# Altium project Stabilizer_Pounder.PrjPCB (part 5 of 5)

## Sheet Mixer_coupler.SchDoc: Pounder
size 420 x 297 mm; Author: G.Kasprowicz; CompanyName: WUT ISE; DrawnBy: G.Kasprowicz; Organization: WUT ISE; Address1: PW ISE; Address2: Nowowiejska 15/19 00-665 Warsaw; Address3: gkasprow@gmail.com; DocumentNumber: 2; Revision: 1.2.1; SheetNumber: 2; SheetTotal: 7; ModifiedBy: -; CheckedDate: -; Title2: Demodulation; DivGrp: WUT ISE; Designer: G.Kasprowicz; ModifiedDate: -; ProjectName: Sensor Box
Used 2 times, as channels Mixer_coupler, Mixer_coupler. Parts and nets are listed once, with the designators drawn on the sheet.
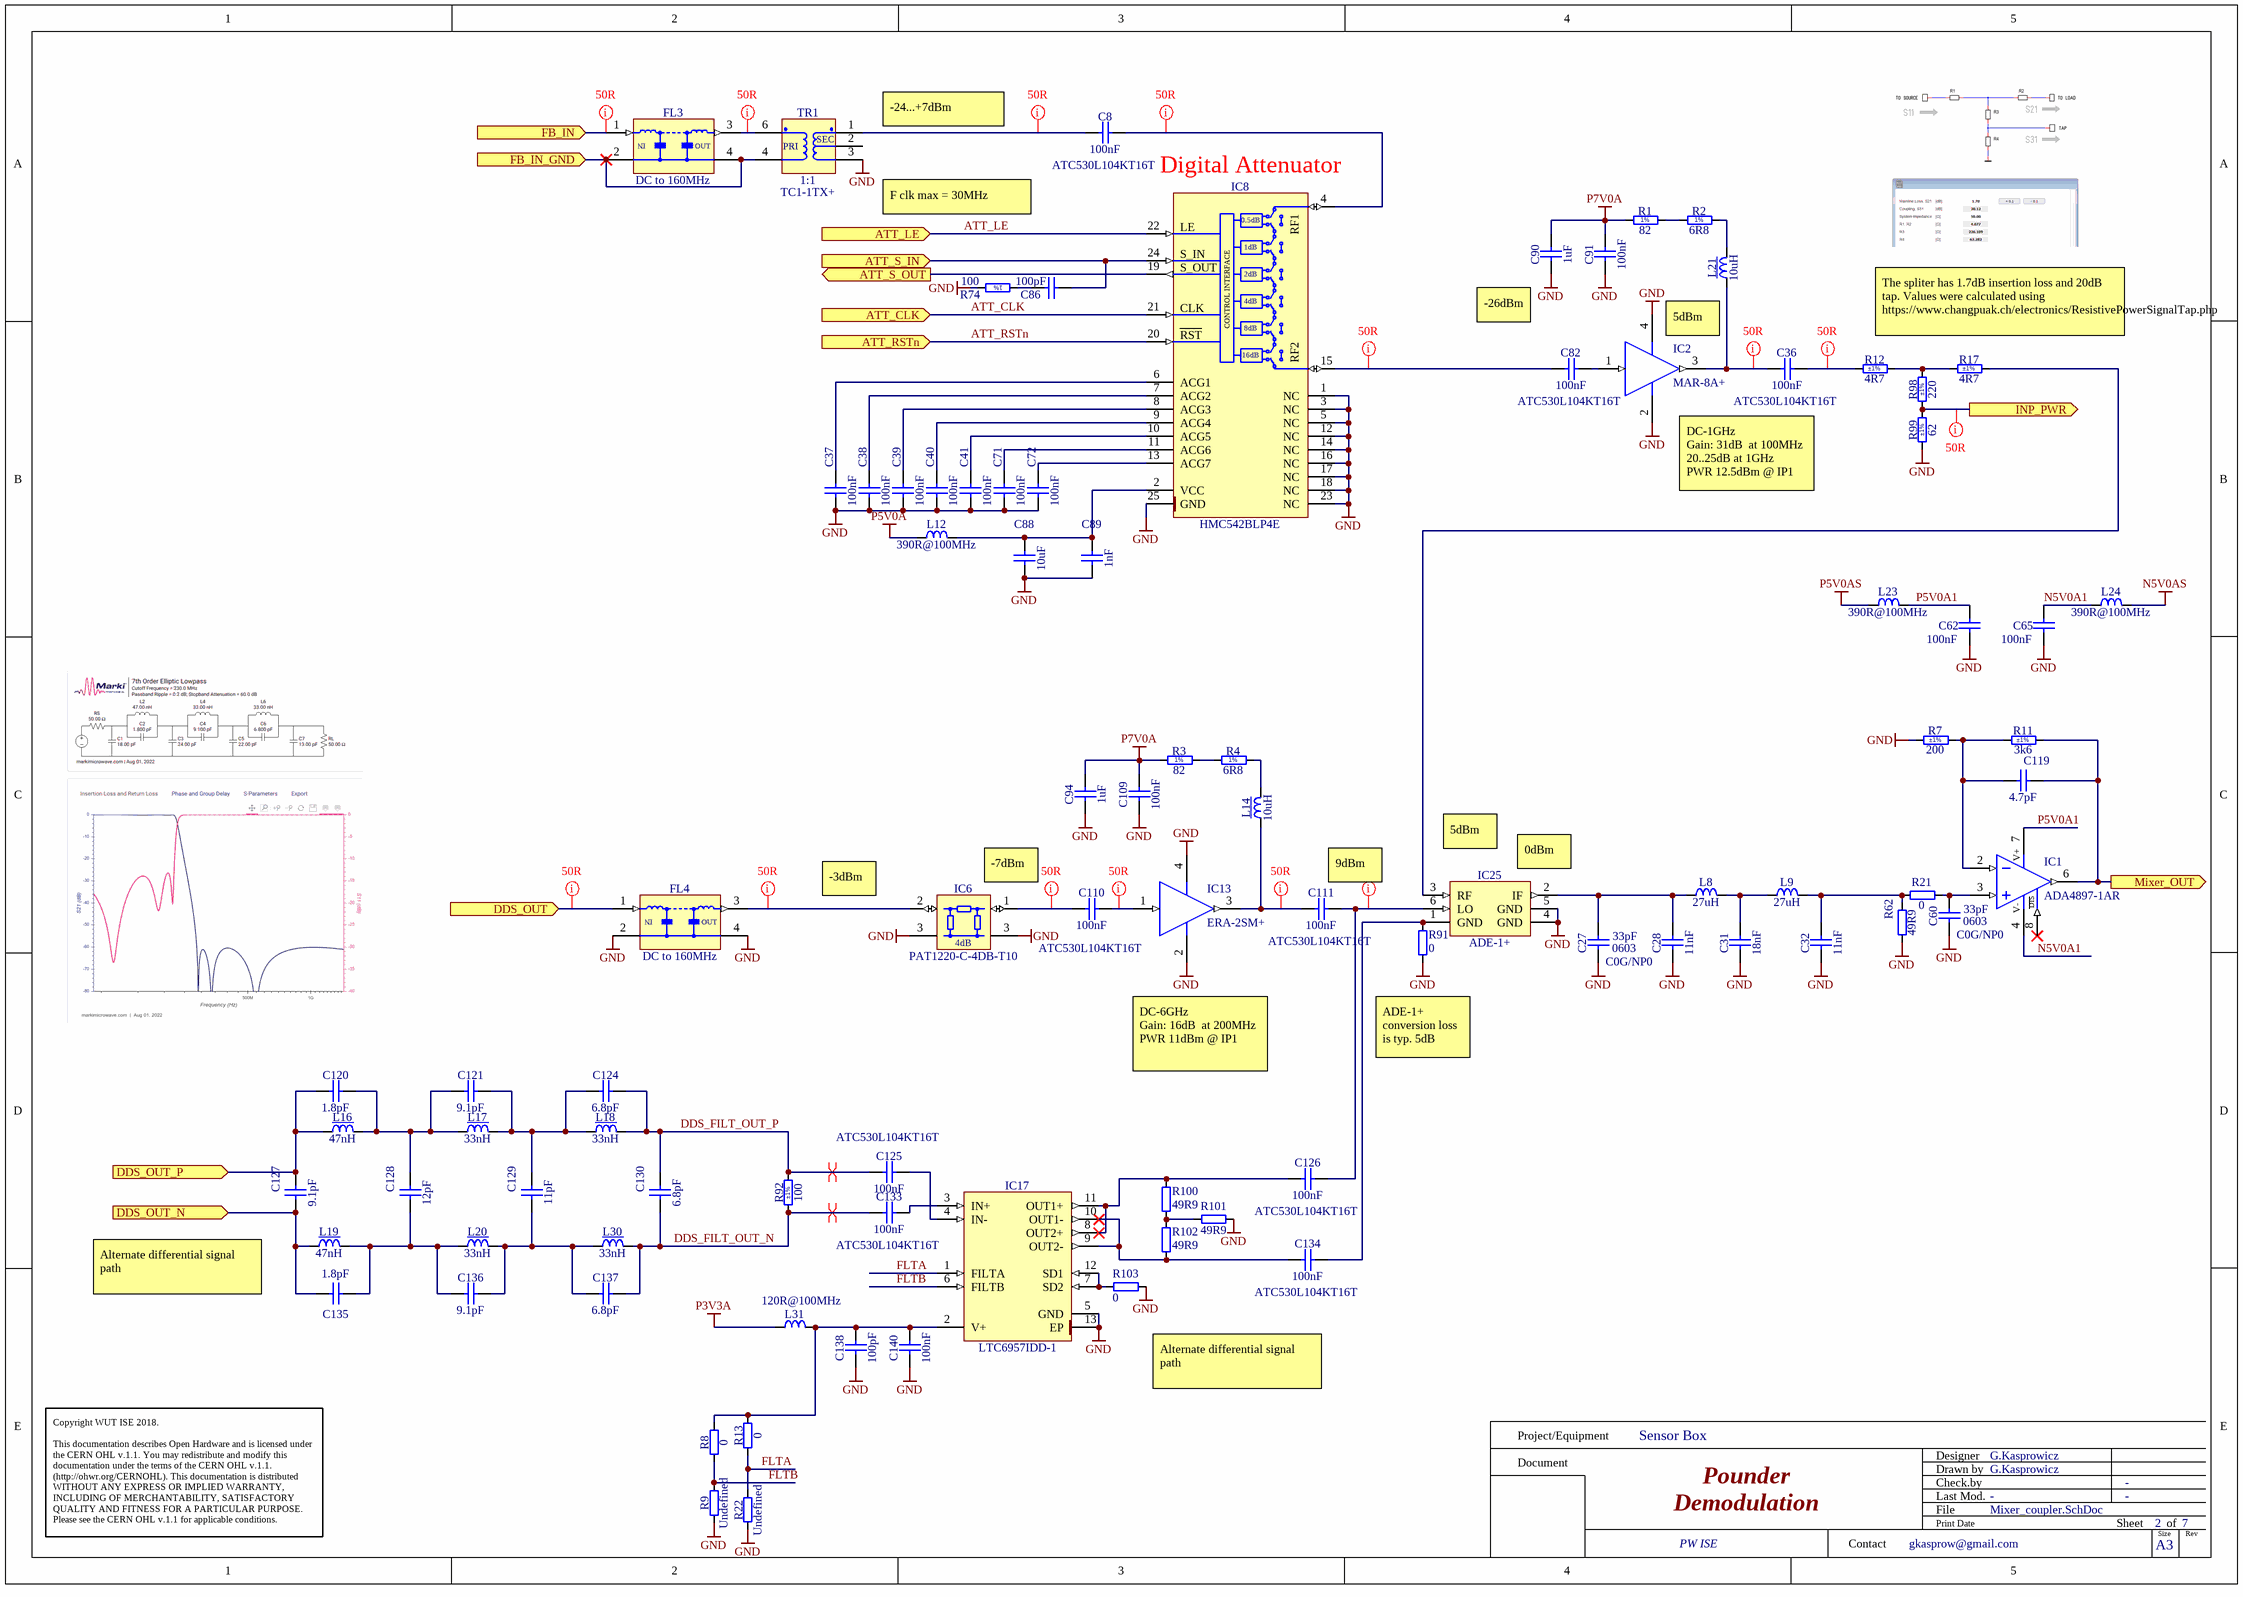
[diagram p6: Mixer_coupler.SchDoc]

### Parts
C8  100nF  Manufacturer Part Number: ATC530L104KT16T  [CAPC1005X70N]
C27  33pF  TC: C0G/NP0  Case: 0603  [CAPC1608X87N]
C28  11nF  [CAPC3216X94N]
C31  18nF  [CAPC3216X94N]
C32  11nF  [CAPC3216X94N]
C36  100nF  Manufacturer Part Number: ATC530L104KT16T  [CAPC1005X70N]
C37  100nF  [CAPC1005X55N]
C38  100nF  [CAPC1005X55N]
C39  100nF  [CAPC1005X55N]
C40  100nF  [CAPC1005X55N]
C41  100nF  [CAPC1005X55N]
C60  33pF  TC: C0G/NP0  Case: 0603  [CAPC1608X87N]
C62  100nF  [CAPC1005X55N]
C65  100nF  [CAPC1005X55N]
C71  100nF  [CAPC1005X55N]
C72  100nF  [CAPC1005X55N]
C82  100nF  Manufacturer Part Number: ATC530L104KT16T  [CAPC1005X70N]
C86  100pF  [CAPC1005X55N]
C88  10uF  [CAPC1608X80N]
C89  1nF  [CAPC1005X55N]
C90  1uF  [CAPC2012X140N]
C91  100nF  [CAPC1005X55N]
C94  1uF  [CAPC2012X140N]
C109  100nF  [CAPC1005X55N]
C110  100nF  Manufacturer Part Number: ATC530L104KT16T  [CAPC1005X70N]
C111  100nF  Manufacturer Part Number: ATC530L104KT16T  [CAPC1005X70N]
C119  4.7pF  [CAPC1005X55N]
C120  1.8pF  [CAPC1005X55N]
C121  9.1pF  [CAPC1005X55N]
C124  6.8pF  [CAPC1005X55N]
C125  100nF  Manufacturer Part Number: ATC530L104KT16T  [CAPC1005X70N]
C126  100nF  Manufacturer Part Number: ATC530L104KT16T  [CAPC1005X70N]
C127  9.1pF  [CAPC1005X55N]
C128  12pF  [CAPC1005X55N]
C129  11pF  [CAPC1005X55N]
C130  6.8pF  [CAPC1005X55N]
C133  100nF  Manufacturer Part Number: ATC530L104KT16T  [CAPC1005X70N]
C134  100nF  Manufacturer Part Number: ATC530L104KT16T  [CAPC1005X70N]
C135  1.8pF  [CAPC1005X55N]
C136  9.1pF  [CAPC1005X55N]
C137  6.8pF  [CAPC1005X55N]
C138  100pF  [CAPC1005X55N]
C140  100nF  [CAPC1005X55N]
FL3  DC to 160MHz  [FIL_MINI-CIRCUITS_FV1206]
FL4  DC to 160MHz  [FIL_MINI-CIRCUITS_FV1206]
IC1  ADA4897-1AR  [SOIC127P600X175-8N]
IC2  MAR-8A+  [MINI-CIRCUITS_VV105]
IC6  PAT1220-C-4DB-T10  [SUSUMU_PAT1220]
IC8  HMC542BLP4E  [QFN50P400X400X100-25N-S295]
IC13  ERA-2SM+  [MINI-CIRCUITS_WW107]
IC17  LTC6957IDD-1  [SON45P300X300X80-13N-R175X248]
IC25  ADE-1+  [MINI-CIRCUITS_CD636]
L8  27uH  [IND_TAIYO-YUDEN_LSQMB201616]
L9  27uH  [IND_TAIYO-YUDEN_LSQMB201616]
L12  390R@100MHz  [INDC1608X95N]
L14  10uH  [IND_MURATA_LQH32C]
L16  47nH  [IND_MURATA_LQW15AN_00]
L17  33nH  [IND_MURATA_LQW15AN_00]
L18  33nH  [IND_MURATA_LQW15AN_00]
L19  47nH  [IND_MURATA_LQW15AN_00]
L20  33nH  [IND_MURATA_LQW15AN_00]
L21  10uH  [IND_MURATA_LQH32C]
L23  390R@100MHz  [INDC1608X95N]
L24  390R@100MHz  [INDC1608X95N]
L30  33nH  [IND_MURATA_LQW15AN_00]
L31  120R@100MHz  [INDC1608X95N]
R1  82  [RESC3216X65N]
R2  6R8  [RESC2012X60N]
R3  82  [RESC3216X65N]
R4  6R8  [RESC2012X60N]
R7  200  Tolerance: ±1%  [RESC1608X55N]
R8  0  [RESC1608X55N]
R9  Undefined  [RESC1608X55N]
R11  3k6  Tolerance: ±1%  [RESC1608X55N]
R12  4R7  Tolerance: ±1%  [RESC1005X40N]
R13  0  [RESC1608X55N]
R17  4R7  Tolerance: ±1%  [RESC1005X40N]
R21  0  [RESC1005X40N]
R22  Undefined  [RESC1608X55N]
R62  49R9  [RESC1608X55N]
R74  100  [RESC1005X40N]
R91  0  [RESC1005X40N]
R92  100  Tolerance: ±1%  [RESC1005X40N]
R98  220  Tolerance: ±1%  [RESC1005X40N]
R99  62  Tolerance: ±1%  [RESC1005X40N]
R100  49R9  [RESC1005X40N]
R101  49R9  [RESC1005X40N]
R102  49R9  [RESC1005X40N]
R103  0  [RESC1005X40N]
TR1  1:1  Manufacturer Part Number: TC1-1TX+  [XFMR_MINI-CIRCUITS_AT1521]

### Ports
ATT_CLK (in), ATT_LE (in), ATT_RSTn (in), ATT_S_IN (in), ATT_S_OUT (out), DDS_OUT (in), DDS_OUT_N (in), DDS_OUT_P (in), FB_IN (in), FB_IN_GND (in), INP_PWR (out), Mixer_OUT (out)

### Nets
GND: C27.1 C28.1 C31.1 C32.1 C37.1 C38.1 C39.1 C40.1 C41.1 C60.1 C62.1 C65.1 C71.1 C72.1 C88.1 C89.1 C90.1 C91.1 C94.1 C109.1 C138.1 C140.1 FL4.2(GND) FL4.4(GND) IC2.2(GND) IC2.4(GND) IC6.3(GND) IC8.1(NC) IC8.3(NC) IC8.5(NC) IC8.12(NC) IC8.14(NC) IC8.16(NC) IC8.17(NC) IC8.18(NC) IC8.23(NC) IC8.25(GND) IC13.2(GND) IC13.4(GND) IC17.5(GND) IC17.13(EP) IC25.4(GND) IC25.5(GND) R7.1 R9.1 R22.1 R62.1 R74.2 R91.2 R99.1 R101.2 R103.1 TR1.3(S)
N5V0AS: L24.2
P3V3A: L31.2
P5V0A: L12.1
P5V0AS: L23.1
P7V0A: C90.2 C91.2 C94.2 C109.2 R1.1 R3.1
ATT_CLK: IC8.21(SHIFT_CLOCK) ; port ATT_CLK
ATT_LE: IC8.22(LATCH_ENABLE) ; port ATT_LE
ATT_RSTn: IC8.20(~{RESET}) ; port ATT_RSTn
ATT_S_IN: C86.2 IC8.24(SERIAL_INPUT) ; port ATT_S_IN
ATT_S_OUT: IC8.19(SERIAL_OUTPUT) ; port ATT_S_OUT
DDS_FILT_OUT_N: C130.1 C133.1 C137.2 L30.2 R92.1
DDS_FILT_OUT_P: C124.2 C125.1 C130.2 L18.2 R92.2
DDS_OUT: FL4.1(RFIN) ; port DDS_OUT
DDS_OUT_N: C127.1 C135.1 L19.1 ; port DDS_OUT_N
DDS_OUT_P: C120.1 C127.2 L16.1 ; port DDS_OUT_P
FB_IN: FL3.1(RFIN) ; port FB_IN
FB_IN_GND: FL3.2(GND) FL3.4(GND) TR1.4(P) ; port FB_IN_GND
FLTA: IC17.1(FILTA) R13.1 R22.2
FLTB: IC17.6(FILTB) R8.1 R9.2
INP_PWR: R98.1 R99.2 ; port INP_PWR
Mixer_OUT: C119.2 IC1.6(OUT) R11.2 ; port Mixer_OUT
N5V0A1: C65.2 IC1.4(V-) L24.1
P5V0A1: C62.2 IC1.7(V+) L23.2
NetC8_1: C8.1 TR1.1(SDOT)
NetC8_2: C8.2 IC8.4(RF1)
NetC27_2: C27.2 C28.2 IC25.2(IF) L8.1
NetC31_2: C31.2 L8.2 L9.1
NetC32_2: C32.2 L9.2 R21.1 R62.2
NetC36_1: C36.1 IC2.3(RF_OUT) L21.1
NetC36_2: C36.2 R12.1
NetC37_2: C37.2 IC8.6(ACG1)
NetC38_2: C38.2 IC8.7(ACG2)
NetC39_2: C39.2 IC8.8(ACG3)
NetC40_2: C40.2 IC8.9(ACG4)
NetC41_2: C41.2 IC8.10(ACG5)
NetC60_2: C60.2 IC1.3(IN+) R21.2
NetC71_2: C71.2 IC8.11(ACG6)
NetC72_2: C72.2 IC8.13(ACG7)
NetC82_1: C82.1 IC8.15(RF2)
NetC82_2: C82.2 IC2.1(RF_IN)
NetC86_1: C86.1 R74.1
NetC88_2: C88.2 C89.2 IC8.2(VCC) L12.2
NetC110_1: C110.1 IC6.1(IN)
NetC110_2: C110.2 IC13.1(RF_IN)
NetC111_1: C111.1 IC13.3(RF_OUT) L14.1
NetC111_2: C111.2 C126.2 IC25.6(LO)
NetC119_1: C119.1 IC1.2(IN-) R7.2 R11.1
NetC120_2: C120.2 C121.1 C128.2 L16.2 L17.1
NetC121_2: C121.2 C124.1 C129.2 L17.2 L18.1
NetC125_2: C125.2 IC17.4(IN-)
NetC126_1: C126.1 IC17.8(OUT2+) IC17.11(OUT1+) R100.1
NetC128_1: C128.1 C135.2 C136.1 L19.2 L20.1
NetC129_1: C129.1 C136.2 C137.1 L20.2 L30.1
NetC133_2: C133.2 IC17.3(IN+)
NetC134_1: C134.1 IC17.9(OUT2-) IC17.10(OUT1-) R102.2
NetC134_2: C134.2 IC25.1(GND) R91.1
NetC138_2: C138.2 C140.2 IC17.2(V+) L31.1 R8.2 R13.2
NetFL3_3: FL3.3(RFOUT) TR1.6(PDOT)
NetFL4_3: FL4.3(RFOUT) IC6.2(OUT)
NetIC17_7: IC17.7(SD2) IC17.12(SD1) R103.2
NetIC25_3: IC25.3(RF) R17.2
NetL14_2: L14.2 R4.2
NetL21_2: L21.2 R2.2
NetR1_2: R1.2 R2.1
NetR3_2: R3.2 R4.1
NetR12_2: R12.2 R17.1 R98.2
NetR100_2: R100.2 R101.1 R102.1

Not connected (* = marked no-connect by the designer): IC1 8(~{DIS})*; TR1 2(NC)

### Channels
Mixer_coupler: designators end in A; ports ATT_CLK=ATT_CLK ATT_LE=ATT_LE ATT_RSTn=ATT_RSTn ATT_S_IN=NetC86A_2 ATT_S_OUT=NetC26B_2 DDS_OUT=NetFL4A_1 DDS_OUT_N=CH3_OUTC_N DDS_OUT_P=CH3_OUTC_P FB_IN=FB1 FB_IN_GND=NetFL3A_2 INP_PWR=NetC114A_1 Mixer_OUT=NetC119A_2
Mixer_coupler: designators end in B; ports ATT_CLK=ATT_CLK ATT_LE=ATT_LE ATT_RSTn=ATT_RSTn ATT_S_IN=NetC86B_2 ATT_S_OUT=NetIC8B_19 DDS_OUT=DDS_OUT1 DDS_OUT_N=CH1_OUTC_N DDS_OUT_P=CH1_OUTC_P FB_IN=FB0 FB_IN_GND=NetFL3B_2 INP_PWR=NetC114B_1 Mixer_OUT=NetC119B_2

### Layout directives
net class Z50R: FB1, NetC8A_1, NetC8A_2, NetC36A_1, NetC36A_2, NetC82A_1, NetC110A_1, NetC110A_2, NetC111A_1, NetC111A_2, NetC114A_1, NetFL3A_3, NetFL4A_1, NetFL4A_3
differential pair: DDS_FILT_OUT_N_Mixer_coupler, DDS_FILT_OUT_P_Mixer_coupler

### Notes on the sheet
- (near TR1) -24...+7dBm
- (near IC8) Digital Attenuator
- F clk max = 30MHz
- (near C90) -26dBm
- (near IC2) 5dBm
- The spliter has 1.7dB insertion loss and 20dB tap. Values were calculated using https://www.changpuak.ch/electronics/ResistivePowerSignalTap.php
- (near IC2) DC-1GHz
  Gain: 31dB  at 100MHz
  20..25dB at 1GHz
  PWR 12.5dBm @ IP1
- (near IC25) 5dBm
- (near IC25) 0dBm
- -3dBm
- (near IC6) -7dBm
- (near C111) 9dBm
- DC-6GHz
  Gain: 16dB  at 200MHz
  PWR 11dBm @ IP1
- (near R91) ADE-1+ conversion loss is typ. 5dB
- Alternate differential signal path
- Project/Equipment
- Document
- Designer
- Drawn by
- Check.by
- Copyright WUT ISE 2018.
  This documentation describes Open Hardware and is licensed under the CERN OHL v.1.1. You may redistribute and modify this documentation under the terms of the CERN OHL v.1.1. (http://ohwr.org/CERNOHL). This documentation is distributed WITHOUT ANY EXPRESS OR IMPLIED WARRANTY, INCLUDING OF MERCHANTABILITY, SATISFACTORY QUALITY AND FITNESS FOR A PARTICULAR PURPOSE. Please see the CERN OHL v.1.1 for applicable conditions.
- Contact
- File
- Last Mod.
- Print Date
- Sheet
- Size
- A3
- of
- Rev
- (in symbol ADA4897-1AR) DIS
- (in symbol FIL_MINI-CIRCUITS_LFCN-160+) IN; OUT
- (in symbol HMC542BLP4E) 0.5dB; LE; 1dB; S_IN; S_OUT; 2dB; CONTROL INTERFACE; 4dB; CLK; 8dB; RST; 16dB
- (in symbol PAT1220-C-4DB-T10) 4dB
- (in symbol R0402_100R_1%_0.0625W_100PPM) 1%
- (in symbol R0805_6R8_1%_0.125W_200PPM) 1%
- (in symbol R1206_82R_1%_0.25W_100PPM) 1%
- (in symbol XFMR_MINI-CIRCUITS_TC1-1TX+) SEC; PRI

### Library data of the parts
C8 C36 C82 C110 C111 C125 C126 C133 C134 = CC0402_100NF_16V_10%_X7R_ATC_ATC530L: Non-polarised capacitor; Part Description: Broadband SMD Multilayer Chip Ceramic Capacitor; Manufacturer: ATC; Voltage: 16V; TC: X7R; Tolerance: ±10%; Part Number: CC0402_100NF_16V_10%_X7R_ATC_ATC530L; Component Kind: Standard; Component Type: Standard; Pin Count: 2; Value: 100nF; Status: Not Recommended; Case: 0402; Mounted: Yes; Socket: No; SMD: Yes; Sense: No; ComponentHeight: 0.61mm; HelpURL: \\cern.ch\dfs\Applications\Altium\Datasheets\CC0402_X7R_ATC_ATC530L104KT16.pdf; Author: CERN DEM BC; CreateDate: 17.11.2017; LatestRevisionDate: 21.11.2017
C27 C60 = CC0603_33PF_50V_5%_NP0: Non-polarised capacitor; Part Description: SMD Multilayer Chip Ceramic Capacitor; Manufacturer: GENERIC; Manufacturer1 Part Number: 223886715339; Voltage: 50V; Tolerance: ±5%; Part Number: CC0603_33PF_50V_5%_NP0; Component Kind: Standard; Component Type: Standard; Pin Count: 2; Value: 33pF; Status: Preferred; Manufacturer Part Number: CC0603_33PF_50V_5%_NP0; Mounted: Yes; Socket: No; SMD: Yes; Sense: No; Manufacturer1 Example: PHYCOMP; Manufacturer1 ComponentHeight: 0.87mm; HelpURL: \\cern.ch\dfs\Applications\Altium\Datasheets\CC0603_NP0_PHYCOMP.pdf; Author: CERN DEM JLC; CreateDate: 03.12.2007; LatestRevisionDate: 03.12.2007
C28 C32 = CC1206_11NF_50V_5%_NP0: Non-polarised capacitor; Part Description: SMD Multilayer Chip Ceramic Capacitor; Manufacturer: GENERIC; Manufacturer1 Part Number: GRM3195C1H113JA01; Voltage: 50V; TC: NP0; Tolerance: ±5%; Part Number: CC1206_11NF_50V_5%_NP0; Component Kind: Standard; Component Type: Standard; Pin Count: 2; Value: 11nF; Status: None; Manufacturer Part Number: CC1206_11NF_50V_5%_NP0; Case: 1206; Mounted: Yes; Socket: No; SMD: Yes; Sense: No; Manufacturer1 Example: MURATA; Manufacturer1 ComponentHeight: 0.95mm; HelpURL: \\cern.ch\dfs\Applications\Altium\Datasheets\CC1206_NP0_MURATA_GRM3195C1H113JA01.pdf; Author: CERN DEM HF; CreateDate: 05.08.2022; LatestRevisionDate: 05.08.2022
C31 = CC1206_18NF_50V_5%_NP0: Non-polarised capacitor; Part Description: SMD Multilayer Chip Ceramic Capacitor; Manufacturer: GENERIC; Manufacturer1 Part Number: GRM3195C1H113JA01; Voltage: 50V; TC: NP0; Tolerance: ±5%; Part Number: CC1206_18NF_50V_5%_NP0; Component Kind: Standard; Component Type: Standard; Pin Count: 2; Value: 18nF; Status: None; Manufacturer Part Number: CC1206_18NF_50V_5%_NP0; Case: 1206; Mounted: Yes; Socket: No; SMD: Yes; Sense: No; Manufacturer1 Example: MURATA; Manufacturer1 ComponentHeight: 0.95mm; HelpURL: \\cern.ch\dfs\Applications\Altium\Datasheets\CC1206_NP0_MURATA_GRM3195C1H183JA01.pdf; Author: CERN DEM HF; CreateDate: 05.08.2022; LatestRevisionDate: 05.08.2022
C37-C41 C71 C72 C91 C109 C140 = CC0402_100NF_16V_10%_X5R: as C14-C20 on sheet Digital_Attenuator; Part Number: CC0402_100NF_16V_10%_X5R; Component Kind: Standard; Component Type: Standard; Pin Count: 2; Value: 100nF; Status: None; Manufacturer Part Number: CC0402_100NF_16V_10%_X5R; Case: 0402; Mounted: Yes; Socket: No; SMD: Yes; Sense: No; Manufacturer1 Example: MURATA; Manufacturer1 ComponentHeight: 0.55mm; HelpURL: \\cern.ch\dfs\Applications\Altium\Datasheets\CC0402_X5R_MURATA_GRM.pdf; Author: CERN DEM JLC; CreateDate: 10.12.2013; LatestRevisionDate: 10.12.2013
C62 C65 = CC0402_100NF_16V_10%_X7R: Non-polarised capacitor; Part Description: SMD Multilayer Chip Ceramic Capacitor; Manufacturer: GENERIC; Manufacturer1 Part Number: GRM155R71C104KA88D; Voltage: 16V; TC: X7R; Tolerance: ±10%; Part Number: CC0402_100NF_16V_10%_X7R; Component Kind: Standard; Component Type: Standard; Pin Count: 2; Value: 100nF; Status: Not Recommended; Manufacturer Part Number: CC0402_100NF_16V_10%_X7R; Case: 0402; Mounted: Yes; Socket: No; SMD: Yes; Sense: No; Manufacturer1 Example: MURATA; Manufacturer1 ComponentHeight: 0.55mm; HelpURL: \\cern.ch\dfs\Applications\Altium\Datasheets\CC0402_X7R_MURATA_GRM.pdf; Author: CERN DEM JLC; CreateDate: 2013-12-05; LatestRevisionDate: 2007-12-03
C86 C138 = CC0402_100PF_50V_5%_C0G: Non-polarised capacitor; Part Description: SMD Multilayer Chip Ceramic Capacitor; Manufacturer: GENERIC; Manufacturer1 Part Number: C0402C101J5GACTU; Voltage: 50V; TC: C0G/NP0; Tolerance: ±5%; Part Number: CC0402_100PF_50V_5%_C0G; Component Kind: Standard; Component Type: Standard; Pin Count: 2; Value: 100pF; Status: Preferred; Manufacturer Part Number: CC0402_100PF_50V_5%_C0G; Case: 0402; Mounted: Yes; Socket: No; SMD: Yes; Sense: No; Manufacturer1 Example: KEMET; Manufacturer1 ComponentHeight: 0.55mm; Author: CERN DEM JLC; CreateDate: 03.12.2007; LatestRevisionDate: 22.04.2015
  C86: HelpURL: \\cern.ch\dfs\Applications\Altium\Datasheets\CC0805_C0G_KEMET_(Commercial Grade).pdf
  C138: HelpURL: \\cern.ch\dfs\Applications\Altium\Datasheets\CC0402_C0G_KEMET_(Commercial Grade).pdf
C88 = CC0603_10UF_16V_20%_X5R: Non-polarised capacitor; Part Description: SMD Multilayer Chip Ceramic Capacitor; Manufacturer: GENERIC; Manufacturer1 Part Number: GRM188R61C106MA73D; Voltage: 16V; TC: X5R; Tolerance: ±20%; Part Number: CC0603_10UF_16V_20%_X5R; Component Kind: Standard; Component Type: Standard; Pin Count: 2; Value: 10uF; Status: None; Manufacturer Part Number: CC0603_10UF_16V_20%_X5R; Case: 0603; Mounted: Yes; Socket: No; SMD: Yes; Sense: No; Manufacturer1 Example: MURATA; Manufacturer1 ComponentHeight: 0.8mm; HelpURL: \\cern.ch\dfs\Applications\Altium\Datasheets\CC0603_X5R_MURATA_GRM.pdf; Author: CERN DEM MR; CreateDate: 2016-03-02; LatestRevisionDate: 2016-03-02
C89 = CC0402_1NF_50V_10%_X7R: Non-polarised capacitor; Part Description: SMD Multilayer Chip Ceramic Capacitor; Manufacturer: GENERIC; Manufacturer1 Part Number: 223858715623; Voltage: 50V; TC: X7R; Tolerance: ±10%; Part Number: CC0402_1NF_50V_10%_X7R; Component Kind: Standard; Component Type: Standard; Pin Count: 2; Value: 1nF; Status: Not Recommended; Manufacturer Part Number: CC0402_1NF_50V_10%_X7R; Case: 0402; Mounted: Yes; Socket: No; SMD: Yes; Sense: No; Manufacturer1 Example: PHYCOMP; Manufacturer1 ComponentHeight: 0.55mm; HelpURL: \\cern.ch\dfs\Applications\Altium\Datasheets\CC0402_X7R_PHYCOMP.pdf; Author: CERN DEM JLC; CreateDate: 2007-12-03; LatestRevisionDate: 2007-12-03
C90 C94 = CC0805_1UF_35V_20%_X7R: Non-polarised capacitor; Part Description: SMD Multilayer Chip Ceramic Capacitor; Manufacturer: GENERIC; Manufacturer1 Part Number: GMK212B7105MG-T; Voltage: 35V; TC: X7R; Tolerance: ±20%; Part Number: CC0805_1UF_35V_20%_X7R; Component Kind: Standard; Component Type: Standard; Pin Count: 2; Value: 1uF; Status: Not Recommended; Manufacturer Part Number: CC0805_1UF_35V_20%_X7R; Case: 0805; Mounted: Yes; Socket: No; SMD: Yes; Sense: No; Manufacturer1 Example: TAIYO YUDEN; Manufacturer1 ComponentHeight: 1.35mm; HelpURL: \\cern.ch\dfs\Applications\Altium\Datasheets\CC0805_X7R_TAIYO-YUDEN_HIGH-VALUE.pdf; Author: CERN DEM JLC; CreateDate: 2011-06-22; LatestRevisionDate: 2011-06-22
C119 = CC0402_4.7PF_50V_0.25PF_C0G: Non-polarised capacitor; Part Description: SMD Multilayer Chip Ceramic Capacitor; Manufacturer: GENERIC; Manufacturer1 Part Number: C0402C479C5GACTU; Voltage: 50V; TC: C0G/NP0; Tolerance: ±0.25pF; Part Number: CC0402_4.7PF_50V_0.25PF_C0G; Component Kind: Standard; Component Type: Standard; Pin Count: 2; Value: 4.7pF; Status: Preferred; Manufacturer Part Number: CC0402_4.7PF_50V_0.25PF_C0G; Case: 0402; Mounted: Yes; Socket: No; SMD: Yes; Sense: No; Manufacturer1 Example: KEMET; Manufacturer1 ComponentHeight: 0.55mm; HelpURL: \\cern.ch\dfs\Applications\Altium\Datasheets\CC0402_C0G_KEMET_(Commercial Grade).pdf; Author: CERN DEM JLC; CreateDate: 03.12.2007; LatestRevisionDate: 22.04.2015
C120 C135 = CC0402_1.8PF_50V_0.25PF_C0G: Non-polarised capacitor; Part Description: SMD Multilayer Chip Ceramic Capacitor; Manufacturer: GENERIC; Manufacturer1 Part Number: C0402C189C5GACTU; Voltage: 50V; TC: C0G/NP0; Tolerance: ±0.25pF; Part Number: CC0402_1.8PF_50V_0.25PF_C0G; Component Kind: Standard; Component Type: Standard; Pin Count: 2; Value: 1.8pF; Status: Preferred; Manufacturer Part Number: CC0402_1.8PF_50V_0.25PF_C0G; Case: 0402; Mounted: Yes; Socket: No; SMD: Yes; Sense: No; Manufacturer1 Example: KEMET; Manufacturer1 ComponentHeight: 0.55mm; HelpURL: \\cern.ch\dfs\Applications\Altium\Datasheets\CC0402_C0G_KEMET_(Commercial Grade).pdf; Author: CERN DEM JLC; CreateDate: 04.10.2016; LatestRevisionDate: 04.10.2016
C121 C127 C136 = CC0402_9.1PF_50V_0.1pF_C0G: Non-polarised capacitor; Part Description: SMD Multilayer Chip Ceramic Capacitor; Manufacturer: GENERIC; Manufacturer1 Part Number: GJM1555C1H9R1BB01D; Voltage: 50V; TC: C0G/NP0; Tolerance: ±0.1pF; Part Number: CC0402_9.1PF_50V_0.1pF_C0G; Component Kind: Standard; Component Type: Standard; Pin Count: 2; Value: 9.1pF; Status: Preferred; Manufacturer Part Number: CC0402_9.1PF_50V_0.1pF_C0G; Case: 0402; Mounted: Yes; Socket: No; SMD: Yes; Sense: No; Manufacturer1 Example: Murata; Manufacturer1 ComponentHeight: 0.55mm; HelpURL: \\cern.ch\dfs\Applications\Altium\Datasheets\CC0402_C0G_KEMET_(Commercial Grade).pdf; Author: GK; CreateDate: 04.10.2016; LatestRevisionDate: 04.10.2016
C124 C130 C137 = CC0402_6.8PF_50V_0.1pF_C0G: Non-polarised capacitor; Part Description: SMD Multilayer Chip Ceramic Capacitor; Manufacturer: GENERIC; Manufacturer1 Part Number: GJM1555C1H6R8BB01D; Voltage: 50V; TC: C0G/NP0; Tolerance: ±0.1pF; Part Number: CC0402_6.8PF_50V_0.1pF_C0G; Component Kind: Standard; Component Type: Standard; Pin Count: 2; Value: 6.8pF; Status: Preferred; Manufacturer Part Number: CC0402_6.8PF_50V_0.1pF_C0G; Case: 0402; Mounted: Yes; Socket: No; SMD: Yes; Sense: No; Manufacturer1 Example: Murata; Manufacturer1 ComponentHeight: 0.55mm; HelpURL: \\cern.ch\dfs\Applications\Altium\Datasheets\CC0402_C0G_KEMET_(Commercial Grade).pdf; Author: GK; CreateDate: 04.10.2016; LatestRevisionDate: 04.10.2016
C128 = CC0402_12PF_50V_5%_C0G: Non-polarised capacitor; Part Description: SMD Multilayer Chip Ceramic Capacitor; Manufacturer: GENERIC; Manufacturer1 Part Number: C0402C120J5GACTU; Voltage: 50V; TC: C0G/NP0; Tolerance: ±5%; Part Number: CC0402_12PF_50V_5%_C0G; Component Kind: Standard; Component Type: Standard; Pin Count: 2; Value: 12pF; Status: Preferred; Manufacturer Part Number: CC0402_12PF_50V_5%_C0G; Case: 0402; Mounted: Yes; Socket: No; SMD: Yes; Sense: No; Manufacturer1 Example: KEMET; Manufacturer1 ComponentHeight: 0.55mm; HelpURL: \\cern.ch\dfs\Applications\Altium\Datasheets\CC0402_C0G_KEMET_(Commercial Grade).pdf; Author: CERN DEM JLC; CreateDate: 04.10.2016; LatestRevisionDate: 04.10.2016
C129 = CC0402_11PF_25V_1%_C0G: Non-polarised capacitor; Part Description: SMD Multilayer Chip Ceramic Capacitor; Manufacturer: GENERIC; Manufacturer1 Part Number: 04023J110FBSTR; Voltage: 25V; TC: C0G/NP0; Tolerance: ±1%; Part Number: CC0402_11PF_25V_1%_C0G; Component Kind: Standard; Component Type: Standard; Pin Count: 2; Value: 11pF; Status: Preferred; Manufacturer Part Number: CC0402_11PF_25V_1%_C0G; Case: 0402; Mounted: Yes; Socket: No; SMD: Yes; Sense: No; Manufacturer1 Example: Kyocera; Manufacturer1 ComponentHeight: 0.55mm; HelpURL: \\cern.ch\dfs\Applications\Altium\Datasheets\CC0402_C0G_KEMET_(Commercial Grade).pdf; Author: GK; CreateDate: 04.10.2016; LatestRevisionDate: 04.10.2016
FL3 FL4 = FIL_MINI-CIRCUITS_LFCN-160+: 50 Ohms DC to 160MHz Low Pass Filter; Part Description: 50 Ohm Low Pass Filter; Part Number: FIL_MINI-CIRCUITS_LFCN-160+; Component Kind: Standard; Component Type: Standard; Pin Count: 2; Value: DC to 160MHz; Status: None; Manufacturer: MINI-CIRCUITS; Manufacturer Part Number: LFCN-160+; Mounted: Yes; Socket: No; SMD: Yes; Sense: No; ComponentHeight: 0.94mm; HelpURL: \\cern.ch\dfs\Applications\Altium\Datasheets\FIL_MINI-CIRCUITS_LFCN-160+.pdf; Author: CERN DEM MR; CreateDate: 18.10.2019; LatestRevisionDate: 18.10.2019
IC1 = ADA4897-1AR: Operational Amplifier with Disable; Part Description: 1nV/sqrt Hz, Low Power, Rail-to-Rail Output Amplifier; Manufacturer: ANALOG DEVICES; PressFit: No; Bonding: No; Part Number: ADA4897-1AR; Component Kind: Standard; Component Type: Standard; Device: ADA4897-1AR; PackageDescription: SOIC 8, Pitch 1.27mm - Body 4x5mm, IPC Medium Density; Manufacturer Part Number: ADA4897-1AR; Pin Count: 8; Case: SOIC8; Mounted: Yes; Socket: No; SMD: Yes; Sense: No; ComponentHeight: 1.75mm; Author: CERN DEM HF; HelpURL: \\cern.ch\dfs\Applications\Altium\Datasheets\ADA4897.pdf; CreateDate: 04.08.2022; LatestRevisionDate: 04.08.2022
IC2 = RF_MAR-8A+: SMT Gain Block, DC - 1000 MHz, 50Ω; Manufacturer: MINI-CIRCUITS; PressFit: No; Bonding: No; Part Number: MAR-8A+; Component Kind: Standard; Component Type: Standard; Device: MAR-8A+; PackageDescription: MINI-CIRCUITS VV105 Case, Body 2.16mm Diameter X 1.22mm H; Part Description: SMT Gain Block, DC - 1000 MHz, 50Ω; Manufacturer Part Number: MAR-8A+; Pin Count: 4; Mounted: Yes; Socket: No; SMD: Yes; Sense: No; ComponentHeight: 1.22mm; Author: GK; HelpURL: \\cern.ch\dfs\Applications\Altium\Datasheets\ERA-3+.pdf; CreateDate: 02.10.2017; LatestRevisionDate: 02.10.2017
IC6 = PAT1220-C-4DB-T10: DC to 10GHz, 100mW, 50 Ohm, 4dB, Precision Chip Attenuator; Manufacturer: SUSUMU; PressFit: No; Bonding: No; Part Number: PAT1220-C-4DB-T10; Component Kind: Standard; Component Type: Standard; Device: PAT1220-C-4DB-T10; PackageDescription: SUSUMU PAT1220, 4 Pin Attenuator, Size 0805, L 2.00 x W 1.25 H 0.5mm; Part Description: DC to 10GHz, 100mW, 50 Ohm, 4dB, Precision Chip Attenuator; Manufacturer Part Number: PAT1220-C-4DB-T10; Pin Count: 4; Mounted: Yes; Socket: No; SMD: Yes; Sense: No; ComponentHeight: 0.5mm; Author: CERN DEM MR; HelpURL: \\cern.ch\dfs\Applications\Altium\Datasheets\PAT1220-C-4DB-T10.pdf; CreateDate: 04.10.2017; LatestRevisionDate: 04.10.2017
IC8 = HMC542BLP4E: 0.5dB LSB GaAs MMIC 6-bit Digital Serial Control Attenuator, DC - 4GHz; Part Description: 0.5dB LSB GaAs MMIC 6-bit Digital Serial Control Attenuator, DC to 4GHz; Manufacturer: HITTITE MICROWAVE CORP; PressFit: No; Bonding: No; Part Number: HMC542BLP4E; Component Kind: Standard; Component Type: Standard; Device: HMC542BLP4E; PackageDescription: QFN, 0.50mm Pitch, Square; 24 Pin, 4.00mm L X 4.00mm W X 1.00mm H Body (w/thermal Tab 2.95 X 2.95mm), IPC Medium Density; Manufacturer Part Number: HMC542BLP4E; Pin Count: 25; Case: QFN24; Mounted: Yes; Socket: No; SMD: Yes; Sense: No; ComponentHeight: 1mm; Author: CERN DEM JMW; HelpURL: \\cern.ch\dfs\Applications\Altium\Datasheets\HMC542BLP4E.pdf; CreateDate: 2016-08-17; LatestRevisionDate: 2016-08-17
IC13 = ERA-2SM+: Monolithic Amplifier; Part Description: DC-6GHz Monolithic Amplifier; Manufacturer: MINI-CIRCUITS; PressFit: No; Bonding: No; Part Number: ERA-2SM+; Component Kind: Standard; Component Type: Standard; Device: ERA-2SM+; PackageDescription: MINI-CIRCUITS WW107 Case, Body 2.16mm Diameter X 1.52mm H; Manufacturer Part Number: ERA-2SM+; Pin Count: 4; Mounted: Yes; Socket: No; SMD: Yes; Sense: No; ComponentHeight: 1.52mm; Author: CERN DEM JLC; HelpURL: \\cern.ch\dfs\Applications\Altium\Datasheets\ERA-2SM+.pdf; ComponentLink1URL: \\cern.ch\dfs\Applications\Altium\Datasheets\ERA-2SM+_Package-Drawing.pdf; ComponentLink1Description: Package Drawing; CreateDate: 09.12.2013; LatestRevisionDate: 09.12.2013
IC17 = LTC6957IDD-1#PBF: Low Phase Noise, Dual Output Buffer/Driver/Logic Converter, LVPECL Logic Outputs; Manufacturer: LINEAR TECHNOLOGY; PressFit: No; Bonding: No; Part Number: LTC6957IDD-1#PBF; Component Kind: Standard; Component Type: Standard; Device: LTC6957IDD-1; PackageDescription: SON, 0.45mm Pitch; 12 Pin, 3.00mm W X 3.00mm L X 0.80mm H Body (w/Thermal tab 1.75 x 2.48mm), IPC Medium Density; Part Description: Low Phase Noise, Dual Output Buffer/Driver/Logic Converter, LVPECL Logic Outputs; Manufacturer Part Number: LTC6957IDD-1; Pin Count: 13; Case: SON12; Mounted: Yes; Socket: No; SMD: Yes; Sense: No; ComponentHeight: 0.8mm; Author: CERN DEM JLC; HelpURL: \\cern.ch\dfs\Applications\Altium\Datasheets\LTC6957IDD-1#PBF.pdf; CreateDate: 07.12.2016; LatestRevisionDate: 02.02.2022
IC25 = ADE-1+: Frequency Mixer - Level 7 (LO Power +7 dBm) 0.5 to 500 MHz; Manufacturer: MINI-CIRCUITS; PressFit: No; Bonding: No; Part Number: ADE-1+; Component Kind: Standard; Component Type: Standard; Device: ADE-1+; PackageDescription: MINI-CIRCUITS CD636 Case, 2.54mm pitch; 6 pin, 5.59mm W X 7.87mm L; Part Description: Frequency Mixer - Level 7 (LO Power +7 dBm) 0.5 to 500MHz; Manufacturer Part Number: MINI-CIRCUITS_CD636; Pin Count: 6; Mounted: Yes; Socket: No; SMD: Yes; Sense: No; ComponentHeight: 4.11mm; Author: CERN DEM MR; HelpURL: \\cern.ch\dfs\Applications\Altium\Datasheets\ADE-1+.pdf; CreateDate: 21.10.2019; LatestRevisionDate: 21.10.2019
L8 L9 = IND_27UH_5%_TAIYO-YUDEN_LSQMB201616T270J: Inductor; Part Description: Surface Mount Inductor, LSQM Series; Manufacturer: TAIYO YUDEN; Power: 0.13A; Resistance: 3.2R; Tolerance: ±5%; Part Number: IND_27UH_5%_TAIYO-YUDEN_LSQMB201616T270J; Component Kind: Standard; Component Type: Standard; Pin Count: 2; Value: 27uH; Manufacturer Part Number: LSQMB201616T270J; Mounted: Yes; Socket: No; SMD: Yes; Sense: No; ComponentHeight: 1.8mm; HelpURL: \\cern.ch\dfs\Applications\Altium\Datasheets\IND_TAIYO-YUDEN_LSQMB201616T270J.pdf; Author: CERN DEM HF; CreateDate: 04.08.2022; LatestRevisionDate: 04.08.2022
L12 L23 L24 = IND0603_TDK_MPZ1608R391A: Inductor; Part Description: SMT Chip Bead for Power Line; Manufacturer: TDK; Power: 1.2A; Resistance: 0.12R; Tolerance: ±25%; Part Number: IND0603_TDK_MPZ1608R391A; Component Kind: Standard; Component Type: Standard; Pin Count: 2; Value: 390R@100MHz; Status: None; Manufacturer Part Number: MPZ1608R391A; Case: 0603; Mounted: Yes; Socket: No; SMD: Yes; Sense: No; ComponentHeight: 0.95mm; HelpURL: \\cern.ch\dfs\Applications\Altium\Datasheets\IND0603_TDK_MPZ1608.pdf; Author: CERN DEM JLC; CreateDate: 2009-12-02; LatestRevisionDate: 2009-12-02
L14 L21 = IND_10UH_10%_MURATA_LQH32CN100K33L: Inductor With Core; Part Description: Chip Inductor (Chip Coil) for Choke Wire Wound Type; Manufacturer: MURATA; Power: 450mA; Resistance: 0.3R; Tolerance: ±10%; Part Number: IND_10UH_10%_MURATA_LQH32CN100K33L; Component Kind: Standard; Component Type: Standard; Pin Count: 2; Value: 10uH; Status: None; Manufacturer Part Number: LQH32CN100K33L; Mounted: Yes; Socket: No; SMD: Yes; Sense: No; ComponentHeight: 2.2mm; HelpURL: \\cern.ch\dfs\Applications\Altium\Datasheets\IND_MURATA_LQH32CN_33.pdf; Author: CERN DEM JLC; CreateDate: 06.04.2009; LatestRevisionDate: 04.07.2018
L16 L19 = IND0402_47NH_2%_MURATA_LQW15AN47NG00: Inductor With Core; Part Description: Wire Wound RF Inductor; Manufacturer: MURATA; Power: 210mA; Resistance: 1R08; Tolerance: ±2%; Part Number: IND0402_47NH_2%_MURATA_LQW15AN47NG00; Component Kind: Standard; Component Type: Standard; Pin Count: 2; Value: 47nH; Manufacturer Part Number: LQW15AN47NG00; Case: 0402; Mounted: Yes; Socket: No; SMD: Yes; Sense: No; ComponentHeight: 0.6mm; HelpURL: \\cern.ch\dfs\Applications\Altium\Datasheets\IND_MURATA_LQW15AN47NG00.pdf; Author: CERN DEM HF; CreateDate: 05.08.2022; LatestRevisionDate: 05.08.2022
L17 L18 L20 L30 = IND0402_33NH_2%_MURATA_LQW15AN33NG00: Inductor With Core; Part Description: Wire Wound RF Inductor; Manufacturer: MURATA; Power: 260mA; Resistance: 0R63; Tolerance: ±2%; Part Number: IND0402_33NH_2%_MURATA_LQW15AN33NG00; Component Kind: Standard; Component Type: Standard; Pin Count: 2; Value: 33nH; Manufacturer Part Number: LQW15AN33NG00; Case: 0402; Mounted: Yes; Socket: No; SMD: Yes; Sense: No; ComponentHeight: 0.6mm; HelpURL: \\cern.ch\dfs\Applications\Altium\Datasheets\IND_MURATA_LQW15AN33NG00.pdf; Author: CERN DEM HF; CreateDate: 05.08.2022; LatestRevisionDate: 05.08.2022
L31 = IND0603_MURATA_BLM18PG121SN1D: Inductor; Part Description: SMD EMIFIL Chip Ferrite Bead; Manufacturer: MURATA; Power: 2A; Resistance: 0.05R; Part Number: IND0603_MURATA_BLM18PG121SN1D; Component Kind: Standard; Component Type: Standard; Pin Count: 2; Value: 120R@100MHz; Status: None; Manufacturer Part Number: BLM18PG121SN1D; Case: 0603; Mounted: Yes; Socket: No; SMD: Yes; Sense: No; ComponentHeight: 0.95mm; HelpURL: \\cern.ch\dfs\Applications\Altium\Datasheets\IND0603_MURATA_BLM18P.pdf; Author: CERN DEM BC; CreateDate: 2015-07-27; LatestRevisionDate: 2015-07-27
R1 R3 = R1206_82R_1%_0.25W_100PPM: Resistor - 1%; Part Description: General Purpose Thick Film Chip Resistor; Manufacturer: GENERIC; Manufacturer1 Part Number: NRC12F82R0TRF; Power: 0.25W; TC: ±100ppm/°C; PressFit: No; Part Number: R1206_82R_1%_0.25W_100PPM; Component Kind: Standard; Component Type: Standard; Pin Count: 2; Value: 82; Status: Preferred; Tolerance: ±1%; Manufacturer Part Number: R1206_82R_1%_0.25W_100PPM; Case: 1206; Mounted: Yes; Sense: No; Socket: No; SMD: Yes; Manufacturer1 Example: NIC COMPONENT; Manufacturer1 ComponentHeight: 0.65mm; HelpURL: \\cern.ch\dfs\Applications\Altium\Datasheets\R1206_NIC_NRC.pdf; Author: CERN DEM JLC; CreateDate: 03.12.2007; LatestRevisionDate: 13.03.2008
R2 R4 = R0805_6R8_1%_0.125W_200PPM: Resistor - 1%; Part Description: General Purpose Thick Film Chip Resistor; Manufacturer: GENERIC; Manufacturer1 Part Number: 232273466808L or RC0805FR-076R8L; Power: 0.125W; TC: ±200ppm/°C; PressFit: No; Part Number: R0805_6R8_1%_0.125W_200PPM; Component Kind: Standard; Component Type: Standard; Pin Count: 2; Value: 6R8; Status: Preferred; Tolerance: ±1%; Manufacturer Part Number: R0805_6R8_1%_0.125W_200PPM; Case: 0805; Mounted: Yes; Sense: No; Socket: No; SMD: Yes; Manufacturer1 Example: YAGEO PHYCOMP; Manufacturer1 ComponentHeight: 0.65mm; HelpURL: \\cern.ch\dfs\Applications\Altium\Datasheets\R0805_Phycomp_RC0805.pdf; Author: CERN DEM JLC; CreateDate: 03.12.2007; LatestRevisionDate: 17.10.2012
R7 = R0603_200R_1%_0.1W_100PPM: Resistor - 1%; Part Description: General Purpose Thick Film Chip Resistor; Manufacturer: GENERIC; Manufacturer1 Part Number: NRC06F2000TRF; Power: 0.1W; TC: ±100ppm/°C; PressFit: No; Part Number: R0603_200R_1%_0.1W_100PPM; Component Kind: Standard; Component Type: Standard; Pin Count: 2; Value: 200; Status: Preferred; Manufacturer Part Number: R0603_200R_1%_0.1W_100PPM; Case: 0603; Mounted: Yes; Sense: No; Socket: No; SMD: Yes; Manufacturer1 Example: NIC COMPONENT; Manufacturer1 ComponentHeight: 0.55mm; HelpURL: \\cern.ch\dfs\Applications\Altium\Datasheets\R0603_NIC_NRC.pdf; Author: CERN DEM JLC; CreateDate: 03.12.2007; LatestRevisionDate: 13.03.2008
R8 = R0603_0R_JUMPER: as R86 on sheet Digital_Attenuator; Part Number: R0603_0R_JUMPER; Component Kind: Standard; Component Type: Standard; Pin Count: 2; Value: 0; Status: Preferred; Manufacturer Part Number: R0603_0R_JUMPER; Case: 0603; Mounted: Yes; Sense: No; Socket: No; SMD: Yes; Manufacturer1 Example: NIC COMPONENT; Manufacturer1 ComponentHeight: 0.55mm; HelpURL: \\cern.ch\dfs\Applications\Altium\Datasheets\R0603_NIC_NRC.pdf; Author: CERN DEM JLC; CreateDate: 03.12.2007; LatestRevisionDate: 13.03.2008
R9 R22 = R0603_NO-VALUE: Resistor; Part Description: Reserved Footprint For a 0603 (1608) Chip Resistor; PressFit: No; Mounted: No; Part Number: R0603_NO-VALUE; Component Kind: Standard; Component Type: Standard; Pin Count: 2; Value: Undefined; Status: None; Manufacturer: Undefined; Manufacturer Part Number: R0603_NO-VALUE; Case: 0603; Sense: No; Socket: No; SMD: Yes; Manufacturer1 Example: Undefined; Manufacturer1 Part Number: Undefined; Manufacturer1 ComponentHeight: Undefined; HelpURL: Undefined; Author: CERN DEM JLC; CreateDate: 03.12.2007; LatestRevisionDate: 13.03.2008
R11 = R0603_3K6_1%_0.1W_100PPM: Resistor - 1%; Part Description: General Purpose Thick Film Chip Resistor; Manufacturer: GENERIC; Manufacturer1 Part Number: NRC06F3601TRF; Power: 0.1W; TC: ±100ppm/°C; PressFit: No; Part Number: R0603_3K6_1%_0.1W_100PPM; Component Kind: Standard; Component Type: Standard; Pin Count: 2; Value: 3k6; Status: Preferred; Manufacturer Part Number: R0603_3K6_1%_0.1W_100PPM; Case: 0603; Mounted: Yes; Sense: No; Socket: No; SMD: Yes; Manufacturer1 Example: NIC COMPONENT; Manufacturer1 ComponentHeight: 0.55mm; HelpURL: \\cern.ch\dfs\Applications\Altium\Datasheets\R0603_NIC_NRC.pdf; Author: CERN DEM JLC; CreateDate: 03.12.2007; LatestRevisionDate: 13.03.2008
R12 R17 = R0402_4R7_1%_0.0625W_200PPM: Resistor - 1%; Part Description: General Purpose Thick Film Chip Resistor; Manufacturer: GENERIC; Manufacturer1 Part Number: 232270674708L; TC: ±200ppm/°C; PressFit: No; Part Number: R0402_4R7_1%_0.0625W_200PPM; Component Kind: Standard; Component Type: Standard; Pin Count: 2; Value: 4R7; Status: Not Recommended; Power: 0.0625W; Manufacturer Part Number: R0402_4R7_1%_0.0625W_200PPM; Case: 0402; Mounted: Yes; Sense: No; Socket: No; SMD: Yes; Manufacturer1 Example: YAGEO PHYCOMP; Manufacturer1 ComponentHeight: 0.4mm; HelpURL: \\cern.ch\dfs\Applications\Altium\Datasheets\R0402_Phycomp_RC0402.pdf; Author: CERN DEM JLC; CreateDate: 03.12.2007; LatestRevisionDate: 17.10.2012
R13 = R0603_0R_JUMPER: Resistor; Part Description: 1A (0.05R Max DC Resistance) Zero Ohm Jumper; Manufacturer: GENERIC; Manufacturer1 Part Number: NRC06Z0; PressFit: No; Mounted: No; Part Number: R0603_0R_JUMPER; Component Kind: Standard; Component Type: Standard; Pin Count: 2; Value: 0; Status: Preferred; Manufacturer Part Number: R0603_0R_JUMPER; Case: 0603; Sense: No; Socket: No; SMD: Yes; Manufacturer1 Example: NIC COMPONENT; Manufacturer1 ComponentHeight: 0.55mm; HelpURL: \\cern.ch\dfs\Applications\Altium\Datasheets\R0603_NIC_NRC.pdf; Author: CERN DEM JLC; CreateDate: 03/12/2007; LatestRevisionDate: 13/03/2008
R21 R103 = R0402_0R_JUMPER: Resistor; Part Description: 1A (0.05R Max DC Resistance) Zero Ohm Jumper; Manufacturer: GENERIC; Manufacturer1 Part Number: 232270591001L; PressFit: No; Part Number: R0402_0R_JUMPER; Component Kind: Standard; Component Type: Standard; Pin Count: 2; Value: 0; Status: Not Recommended; Manufacturer Part Number: R0402_0R_JUMPER; Case: 0402; Mounted: Yes; Sense: No; Socket: No; SMD: Yes; Manufacturer1 Example: YAGEO PHYCOMP; Manufacturer1 ComponentHeight: 0.4mm; HelpURL: \\cern.ch\dfs\Applications\Altium\Datasheets\R0402_Phycomp_RC0402.pdf; Author: CERN DEM JLC; CreateDate: 03.12.2007; LatestRevisionDate: 17.10.2012
R62 = R0603_49R9_1%_0.1W_100PPM: Resistor - 1%; Part Description: General Purpose Thick Film Chip Resistor; Manufacturer: GENERIC; Manufacturer1 Part Number: RC0603FR-0749R9L; Power: 0.1W; TC: ±100ppm/°C; PressFit: No; Part Number: R0603_49R9_1%_0.1W_100PPM; Component Kind: Standard; Component Type: Standard; Pin Count: 2; Value: 49R9; Status: Preferred; Tolerance: ±1%; Manufacturer Part Number: R0603_49R9_1%_0.1W_100PPM; Case: 0603; Mounted: Yes; Sense: No; Socket: No; SMD: Yes; Manufacturer1 Example: YAGEO PHYCOMP; Manufacturer1 ComponentHeight: 0.55mm; HelpURL: \\cern.ch\dfs\Applications\Altium\Datasheets\R0603_PHYCOMP_RC0603.pdf; Author: CERN DEM JLC; CreateDate: 21.11.2017; LatestRevisionDate: 21.11.2017
R74 R92 = R0402_100R_1%_0.0625W_100PPM: Resistor - 1%; Part Description: General Purpose Thick Film Chip Resistor; Manufacturer: GENERIC; Manufacturer1 Part Number: 232270671001L; TC: ±100ppm/°C; PressFit: No; Part Number: R0402_100R_1%_0.0625W_100PPM; Component Kind: Standard; Component Type: Standard; Pin Count: 2; Value: 100; Status: Not Recommended; Power: 0.0625W; Manufacturer Part Number: R0402_100R_1%_0.0625W_100PPM; Case: 0402; Mounted: Yes; Sense: No; Socket: No; SMD: Yes; Manufacturer1 Example: YAGEO PHYCOMP; Manufacturer1 ComponentHeight: 0.4mm; HelpURL: \\cern.ch\dfs\Applications\Altium\Datasheets\R0402_Phycomp_RC0402.pdf; Author: CERN DEM JLC; CreateDate: 03.12.2007; LatestRevisionDate: 17.10.2012
  R74: Tolerance: ±1%
R91 = R0402_0R_JUMPER: as R6 on sheet Digital_Attenuator; Part Number: R0402_0R_JUMPER; Component Kind: Standard; Component Type: Standard; Pin Count: 2; Value: 0; Status: Not recommended; Manufacturer Part Number: R0402_0R_JUMPER; Case: 0402; Mounted: Yes; Sense: No; Socket: No; SMD: Yes; Manufacturer1 Example: YAGEO PHYCOMP; Manufacturer1 ComponentHeight: 0.4mm; HelpURL: \\cern.ch\dfs\Applications\Altium\Datasheets\R0402_Phycomp_RC0402.pdf; Author: CERN DEM JLC; CreateDate: 03.12.2007; LatestRevisionDate: 17.10.2012
R98 = R0402_220R_1%_0.0625W_100PPM: Resistor - 1%; Part Description: General Purpose Thick Film Chip Resistor; Manufacturer: GENERIC; Manufacturer1 Part Number: 232270672201L; TC: ±100ppm/°C; PressFit: No; Part Number: R0402_220R_1%_0.0625W_100PPM; Component Kind: Standard; Component Type: Standard; Pin Count: 2; Value: 220; Status: Not Recommended; Power: 0.0625W; Manufacturer Part Number: R0402_220R_1%_0.0625W_100PPM; Case: 0402; Mounted: Yes; Sense: No; Socket: No; SMD: Yes; Manufacturer1 Example: YAGEO PHYCOMP; Manufacturer1 ComponentHeight: 0.4mm; HelpURL: \\cern.ch\dfs\Applications\Altium\Datasheets\R0402_Phycomp_RC0402.pdf; Author: CERN DEM JLC; CreateDate: 03.12.2007; LatestRevisionDate: 17.10.2012
R99 = R0402_62R_1%_0.0625W_100PPM: Resistor - 1%; Part Description: General Purpose Thick Film Chip Resistor; Manufacturer: GENERIC; Manufacturer1 Part Number: 232270676209L; TC: ±100ppm/°C; PressFit: No; Part Number: R0402_62R_1%_0.0625W_100PPM; Component Kind: Standard; Component Type: Standard; Pin Count: 2; Value: 62; Status: Not Recommended; Power: 0.0625W; Manufacturer Part Number: R0402_62R_1%_0.0625W_100PPM; Case: 0402; Mounted: Yes; Sense: No; Socket: No; SMD: Yes; Manufacturer1 Example: YAGEO PHYCOMP; Manufacturer1 ComponentHeight: 0.4mm; HelpURL: \\cern.ch\dfs\Applications\Altium\Datasheets\R0402_Phycomp_RC0402.pdf; Author: CERN DEM JLC; CreateDate: 03.12.2007; LatestRevisionDate: 17.10.2012
R100-R102 = R0402_49R9_1%_0.0625W_100PPM: Resistor - 1%; Part Description: General Purpose Thick Film Chip Resistor; Manufacturer: GENERIC; Manufacturer1 Part Number: 232270674999L or RC0402FR-0749R9L; TC: ±100ppm/°C; PressFit: No; Part Number: R0402_49R9_1%_0.0625W_100PPM; Component Kind: Standard; Component Type: Standard; Pin Count: 2; Value: 49R9; Status: Not Recommended; Power: 0.0625W; Tolerance: ±1%; Manufacturer Part Number: R0402_49R9_1%_0.0625W_100PPM; Case: 0402; Mounted: Yes; Sense: No; Socket: No; SMD: Yes; Manufacturer1 Example: YAGEO PHYCOMP; Manufacturer1 ComponentHeight: 0.4mm; HelpURL: \\cern.ch\dfs\Applications\Altium\Datasheets\R0402_Phycomp_RC0402.pdf; Author: CERN DEM JLC; CreateDate: 24.10.2012; LatestRevisionDate: 24.10.2012
TR1 = XFMR_MINI-CIRCUITS_TC1-1TX+: 50 Ohms 3 to 300MHz RF Transformer; Part Description: 50 Ohms 0.4 to 500MHz RF Transformer; Part Number: XFMR_MINI-CIRCUITS_TC1-1TX+; Component Kind: Standard; Component Type: Standard; Pin Count: 5; Value: 1:1; Status: None; Manufacturer: MINI-CIRCUITS; Mounted: Yes; Socket: No; Sense: No; SMD: Yes; ComponentHeight: 4.06mm; HelpURL: \\cern.ch\dfs\Applications\Altium\Datasheets\XFMR_MINI-CIRCUITS_TC2-1TX+.pdf; Author: GK; CreateDate: 05.01.2020; LatestRevisionDate: 05.01.2020

## Nets that join several sheets
GND: Stabilizer_Pounder (96 pins), power_supplies (81 pins), mechanics (R43.1 R44.1), Quad_DDS (71 pins), Digital_Attenuator (28 pins), PWR_Det (16 pins), Mixer_coupler (53 pins), Digital_Attenuator (28 pins), PWR_Det (16 pins), Mixer_coupler (53 pins)
N5V0AS: power_supplies (5 pins), Mixer_coupler (L24A.2), Mixer_coupler (L24B.2)
N12V0AS: Stabilizer_Pounder (J1.26 J6.16), power_supplies (C49.2 IC5.2 IC5.4)
P1V8A: power_supplies (8 pins), Quad_DDS (8 pins)
P3V3A: power_supplies (8 pins), Quad_DDS (L6.1 T1.2), Mixer_coupler (L31A.2), Mixer_coupler (L31B.2)
P3V3s: Stabilizer_Pounder (12 pins), power_supplies (9 pins)
P5V0A: power_supplies (14 pins), Digital_Attenuator (L11A.1), PWR_Det (L22A.1 R93A.2 T5A.2), Mixer_coupler (L12A.1), Digital_Attenuator (L11B.1), PWR_Det (L22B.1 R93B.2 T5B.2), Mixer_coupler (L12B.1)
P5V0AS: power_supplies (5 pins), Mixer_coupler (L23A.1), Mixer_coupler (L23B.1)
P7V0A: power_supplies (8 pins), Digital_Attenuator (C93A.2 C115A.2 R34A.1), Mixer_coupler (6 pins), Digital_Attenuator (C93B.2 C115B.2 R34B.1), Mixer_coupler (6 pins)
P12V0: Stabilizer_Pounder (J10.31 J10.32 J10.33), power_supplies (12 pins)
P12V0AS: Stabilizer_Pounder (J1.25 J6.15), power_supplies (C34.2 IC3.3)
ATT_CLK: Stabilizer_Pounder (B3.1 C25.2 J10.24 R89.2), Digital_Attenuator (IC4A.21), Mixer_coupler (IC8A.21), Digital_Attenuator (IC4B.21), Mixer_coupler (IC8B.21)
ATT_LE: Stabilizer_Pounder (B10.1 IC16.13 IC19.1), Mixer_coupler (IC8B.22)
ATT_LE: Stabilizer_Pounder (B6.1 IC16.15 IC19.3), Mixer_coupler (IC8A.22)
ATT_LE1: Stabilizer_Pounder (B8.1 IC16.14 IC19.2), Digital_Attenuator (IC4B.22)
ATT_LE3: Stabilizer_Pounder (B5.1 IC16.16 IC19.4), Digital_Attenuator (IC4A.22)
ATT_RSTn: Stabilizer_Pounder (B7.1 IC16.18 IC19.6 R40.2), Digital_Attenuator (IC4A.20), Mixer_coupler (IC8A.20), Digital_Attenuator (IC4B.20), Mixer_coupler (IC8B.20)
CH1_OUTC_N: Quad_DDS (C142.2), Mixer_coupler (C127B.1 C135B.1 L19B.1)
CH1_OUTC_P: Quad_DDS (C141.2), Mixer_coupler (C120B.1 C127B.2 L16B.1)
CH3_OUTC_N: Quad_DDS (C144.2), Mixer_coupler (C127A.1 C135A.1 L19A.1)
CH3_OUTC_P: Quad_DDS (C143.2), Mixer_coupler (C120A.1 C127A.2 L16A.1)
CSn: Stabilizer_Pounder (J10.9), Quad_DDS (B20.1 C13.2 IC23.47)
DDS_OUT1: Quad_DDS (TR3.4), Mixer_coupler (FL4B.1)
DDS_P0: Stabilizer_Pounder (J10.29), Quad_DDS (IC23.40)
DDS_P1: Stabilizer_Pounder (J10.28), Quad_DDS (IC23.41)
DDS_P2: Stabilizer_Pounder (J10.14), Quad_DDS (IC23.42)
DDS_P3: Stabilizer_Pounder (J10.15), Quad_DDS (IC23.43)
DDS_Reset: Stabilizer_Pounder (IC16.17 IC19.5), Quad_DDS (B25.1 IC23.3)
DET_PWRDOWN0: Stabilizer_Pounder (IC16.10 IC19.27), PWR_Det (R94B.2 T4B.1)
DET_PWRDOWN1: Stabilizer_Pounder (IC16.11 IC19.28), PWR_Det (R94A.2 T4A.1)
EXT_CLK_SEL: Stabilizer_Pounder (IC16.20 IC19.8), Quad_DDS (R165.1)
FB0: Stabilizer_Pounder (J9.1), Mixer_coupler (FL3B.1)
FB1: Stabilizer_Pounder (J4.1), Mixer_coupler (FL3A.1)
I2C1_SCL: Stabilizer_Pounder (6 pins), power_supplies (B2.1 R125.1)
I2C1_SDA: Stabilizer_Pounder (6 pins), power_supplies (B1.1 R124.1)
IO_Update: Stabilizer_Pounder (J10.12), Quad_DDS (B18.1 IC23.46)
JADC1_IN2_N: Stabilizer_Pounder (J1.4), PWR_Det (R104B.1)
JADC1_IN2_P: Stabilizer_Pounder (J1.1), PWR_Det (R96B.2 R97B.2)
JADC2_IN2_N: Stabilizer_Pounder (J1.16), PWR_Det (R104A.1)
JADC2_IN2_P: Stabilizer_Pounder (J1.13), PWR_Det (R96A.2 R97A.2)
NetC26B_2: Mixer_coupler (IC8A.19), Digital_Attenuator (C26B.2 IC4B.24)
NetC86A_2: Digital_Attenuator (IC4A.19), Mixer_coupler (C86A.2 IC8A.24)
NetC86B_2: Digital_Attenuator (IC4B.19), Mixer_coupler (C86B.2 IC8B.24)
NetC114A_1: PWR_Det (C114A.1), Mixer_coupler (R98A.1 R99A.2)
NetC114B_1: PWR_Det (C114B.1), Mixer_coupler (R98B.1 R99B.2)
NetC119A_2: Stabilizer_Pounder (R70.1), Mixer_coupler (C119A.2 IC1A.6 R11A.2)
NetC119B_2: Stabilizer_Pounder (R90.1), Mixer_coupler (C119B.2 IC1B.6 R11B.2)
NetFL2A_1: Quad_DDS (TR6.6), Digital_Attenuator (FL2A.1)
NetFL2B_1: Quad_DDS (TR9.4), Digital_Attenuator (FL2B.1)
NetFL3A_2: Stabilizer_Pounder (J4.2 R68.1), Mixer_coupler (FL3A.2 FL3A.4 TR1A.4)
NetFL3B_2: Stabilizer_Pounder (J9.2 R69.1), Mixer_coupler (FL3B.2 FL3B.4 TR1B.4)
NetFL4A_1: Quad_DDS (TR7.6), Mixer_coupler (FL4A.1)
NetIC8B_19: Stabilizer_Pounder (R41.2), Mixer_coupler (IC8B.19)
NetJ3_1: Stabilizer_Pounder (J3.1), Quad_DDS (TR4.4)
NetJ3_2: Stabilizer_Pounder (J3.2 R67.1), Quad_DDS (TR4.6)
NetJ7_2: Stabilizer_Pounder (J7.2), Digital_Attenuator (R19B.2 TR2B.3)
NetJ8_2: Stabilizer_Pounder (J8.2), Digital_Attenuator (R19A.2 TR2A.3)
OSC_ENn: Stabilizer_Pounder (IC16.19 IC19.7), Quad_DDS (T1.1)
OSC_TUNING: Stabilizer_Pounder (J1.19), Quad_DDS (R72.2)
PGOOD: Stabilizer_Pounder (J10.17), power_supplies (9 pins)
QSPI_CLK: Stabilizer_Pounder (J10.8), Quad_DDS (B19.1 C30.2 IC23.48)
QSPI_IO0: Stabilizer_Pounder (J10.6), Quad_DDS (B21.1 C12.2 IC23.50)
QSPI_IO1: Stabilizer_Pounder (J10.5), Quad_DDS (B22.1 C11.2 IC23.51)
QSPI_IO2: Stabilizer_Pounder (J10.3), Quad_DDS (B23.1 C4.2 IC23.52)
QSPI_IO3: Stabilizer_Pounder (J10.2), Quad_DDS (B24.1 C3.2 IC23.53)
RF0: Stabilizer_Pounder (J7.1), Digital_Attenuator (R6B.1 TR2B.1)
RF1: Stabilizer_Pounder (J8.1), Digital_Attenuator (R6A.1 TR2A.1)
SPI1_MOSI: Stabilizer_Pounder (B4.1 J10.20 R88.2), Digital_Attenuator (C26A.2 IC4A.24)
SYNC_CLK: Stabilizer_Pounder (J10.18), Quad_DDS (IC23.54)

## Assembly variants
default: not fitted C44 C66 C120A C120B C121A C121B C124A C124B C126A C126B C127A C127B C128A C128B C129A C129B C130A C130B C134A C134B C135A C135B C136A C136B C137A C137B C141 C142 C143 C144 IC14 IC17A IC17B IC19 J11 J12 J13 L16A L16B L17A L17B L18A L18B L19A L19B L20A L20B L30A L30B OSC2 R6A R6B R9A R19A R19B R22A R67 R68 R69 R73 R86A R86B